# Altium schematic sheet H-bridge.SchDoc
size A3; SheetNumber: 1; SheetTotal: 1
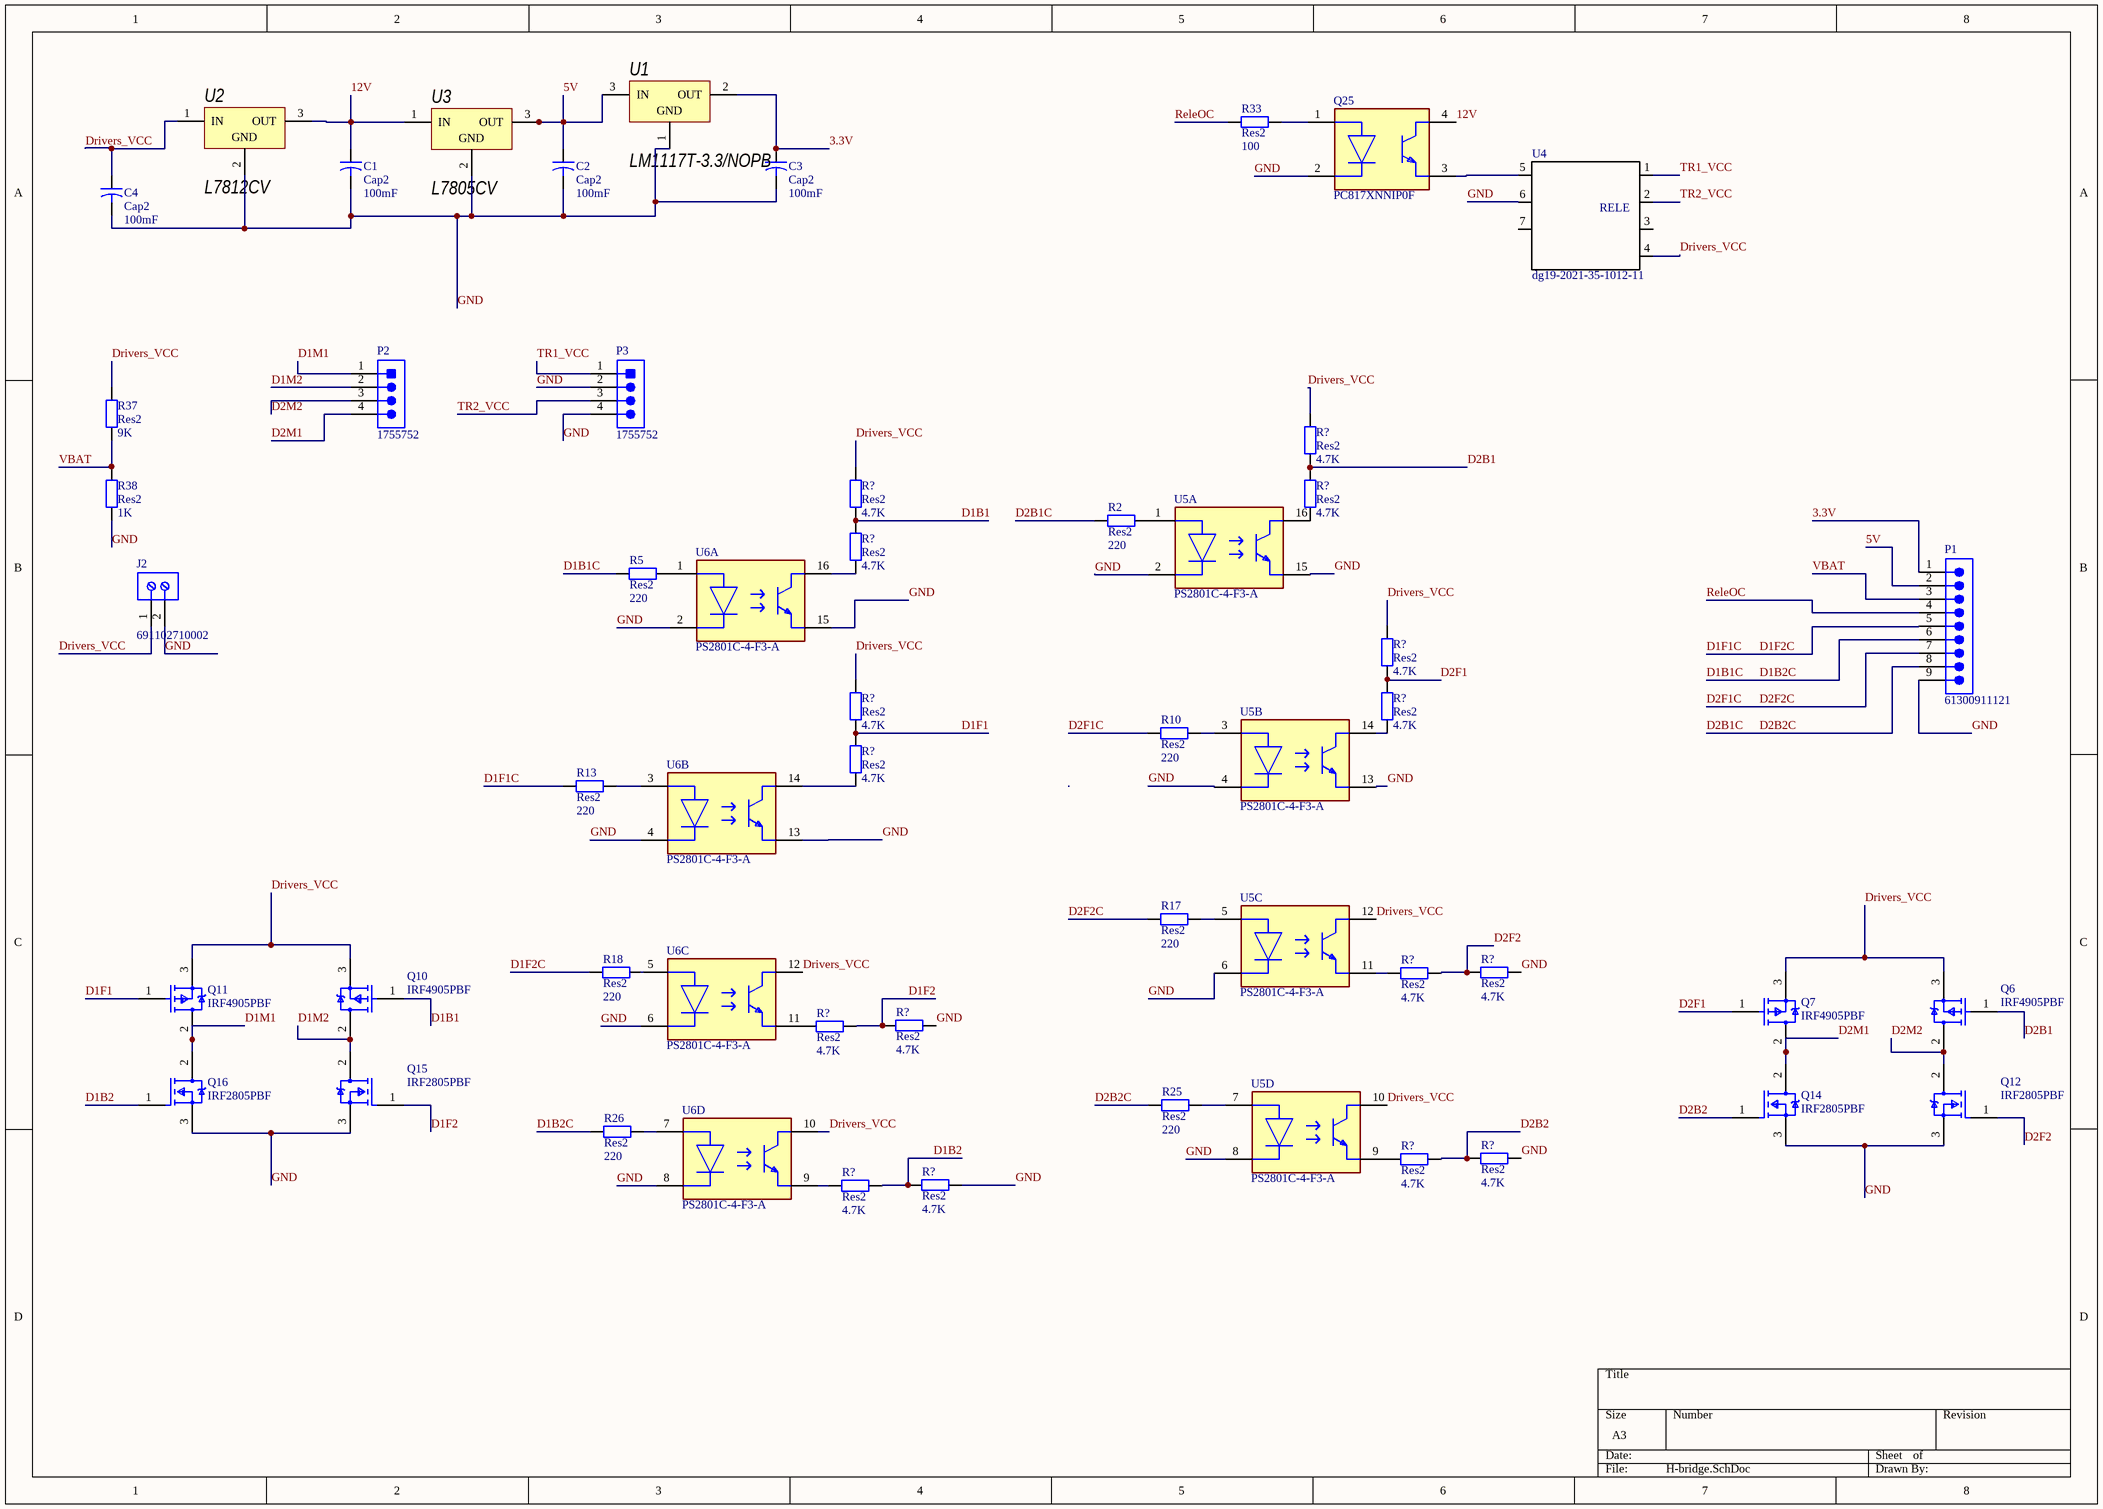
[diagram p0: H-bridge.SchDoc]

## Parts
(Parts that share a designator on the sheet are numbered #1, #2 ... from top to bottom, then left to right.)
C1  Cap2  value 100mF  [CAPR5-4X5]
C2  Cap2  value 100mF  [CAPR5-4X5]
C3  Cap2  value 100mF  [CAPR5-4X5]
C4  Cap2  value 100mF  [CAPR5-4X5]
J2  691102710002  [691102710002]
P1  61300911121  [61300911121]
P2  1755752  [PHOE-1755752-4_V]
P3  1755752  [PHOE-1755752-4_V]
Q6  IRF4905PBF  [FP-PG-TO220-3-MFG]
Q7  IRF4905PBF  [FP-PG-TO220-3-MFG]
Q10  IRF4905PBF  [FP-PG-TO220-3-MFG]
Q11  IRF4905PBF  [FP-PG-TO220-3-MFG]
Q12  IRF2805PBF  [FP-PG-TO220-3-MFG]
Q14  IRF2805PBF  [FP-PG-TO220-3-MFG]
Q15  IRF2805PBF  [FP-PG-TO220-3-MFG]
Q16  IRF2805PBF  [FP-PG-TO220-3-MFG]
Q25  PC817XNNIP0F  [FP-PC817XNNIP0F-MFG]
R2  Res2  value 220  [AXIAL-0.4]
R5  Res2  value 220  [AXIAL-0.4]
R10  Res2  value 220  [AXIAL-0.4]
R13  Res2  value 220  [AXIAL-0.4]
R17  Res2  value 220  [AXIAL-0.4]
R18  Res2  value 220  [AXIAL-0.4]
R25  Res2  value 220  [AXIAL-0.4]
R26  Res2  value 220  [AXIAL-0.4]
R33  Res2  value 100  [AXIAL-0.4]
R37  Res2  value 9K  [AXIAL-0.4]
R38  Res2  value 1K  [AXIAL-0.4]
R?#1  Res2  value 4.7K  [AXIAL-0.4]
R?#2  Res2  value 4.7K  [AXIAL-0.4]
R?#3  Res2  value 4.7K  [AXIAL-0.4]
R?#4  Res2  value 4.7K  [AXIAL-0.4]
R?#5  Res2  value 4.7K  [AXIAL-0.4]
R?#6  Res2  value 4.7K  [AXIAL-0.4]
R?#7  Res2  value 4.7K  [AXIAL-0.4]
R?#8  Res2  value 4.7K  [AXIAL-0.4]
R?#9  Res2  value 4.7K  [AXIAL-0.4]
R?#10  Res2  value 4.7K  [AXIAL-0.4]
R?#11  Res2  value 4.7K  [AXIAL-0.4]
R?#12  Res2  value 4.7K  [AXIAL-0.4]
R?#13  Res2  value 4.7K  [AXIAL-0.4]
R?#14  Res2  value 4.7K  [AXIAL-0.4]
R?#15  Res2  value 4.7K  [AXIAL-0.4]
R?#16  Res2  value 4.7K  [AXIAL-0.4]
U1  LM1117T-3.3/NOPB  [NDE0003A]
U2  L7812CV  [TO220]
U3  L7805CV  [TO220]
U4  dg19-2021-35-1012-11  [DG19-2021-35-1012-11]
U5  PS2801C-4-F3-A  [FP-PS2801C-4-F3-A-MFG]  (parts A,B,C,D of 4)
U6  PS2801C-4-F3-A  [FP-PS2801C-4-F3-A-MFG]  (parts A,B,C,D of 4)

## Nets
3.3V: C3.1 P1.1 U1.2(OUT)
5V: C2.1 P1.2 U1.3(IN) U3.3(OUT)
12V: C1.1 Q25.4(C) U2.3(OUT) U3.1(IN)
D1B1: Q10.1(GATE) R?#2.2 R?#4.1
D1B1C: P1.6 R5.1 R26.1  [also labelled D1B2C]
D1B2: Q16.1(G) R?#15.1 R?#16.2
D1F1: Q11.1(GATE) R?#6.2 R?#8.1
D1F1C: P1.5 R13.1 R18.1  [also labelled D1F2C]
D1F2: Q15.1(G) R?#11.1 R?#12.2
D1M1: P2.1 Q11.2(DRAIN) Q16.2(D)
D1M2: P2.2 Q10.2(DRAIN) Q15.2(D)
D2B1: Q6.1(GATE) R?#1.2 R?#3.1
D2B1C: P1.8 R2.1 R25.1  [also labelled D2B2C]
D2B2: Q14.1(G) R?#13.1 R?#14.2
D2F1: Q7.1(GATE) R?#5.2 R?#7.1
D2F1C: P1.7 R10.1 R17.1  [also labelled D2F2C]
D2F2: Q12.1(G) R?#9.1 R?#10.2
D2M1: P2.4 Q7.2(DRAIN) Q14.2(D)
D2M2: P2.3 Q6.2(DRAIN) Q12.2(D)
Drivers_VCC: C4.1 J2.1 Q6.3(SOURCE) Q7.3(SOURCE) Q10.3(SOURCE) Q11.3(SOURCE) R37.2 R?#1.1 R?#2.1 R?#5.1 R?#6.1 U2.1(IN) U4.4(VCC_NC) U5.10(C) U5.12(C) U6.10(C) U6.12(C)
GND: C1.2 C2.2 C3.2 C4.2 J2.2 P1.9 P3.2 P3.4 Q12.3(S) Q14.3(S) Q15.3(S) Q16.3(S) Q25.2(C) R38.1 R?#10.1 R?#12.1 R?#14.1 R?#16.1 U1.1(GND) U2.2(GND) U3.2(GND) U4.6(CP_2) U5.2(1_CATHODE) U5.4(2_CATHODE) U5.6(3_CATHODE) U5.8(4_CATHODE) U5.13(E) U5.15(E) U6.2(1_CATHODE) U6.4(2_CATHODE) U6.6(3_CATHODE) U6.8(4_CATHODE) U6.13(E) U6.15(E)
ReleOC: P1.4 R33.1
TR1_VCC: P3.1 U4.1(output1)
TR2_VCC: P3.3 U4.2(output2)
VBAT: P1.3 R37.1 R38.2
NetQ25_1: Q25.1(A) R33.2
NetQ25_3: Q25.3(E) U4.5(CP_1)
NetR2_2: R2.2 U5.1(1_ANODE)
NetR5_2: R5.2 U6.1(1_ANODE)
NetR10_2: R10.2 U5.3(2_ANODE)
NetR13_2: R13.2 U6.3(2_ANODE)
NetR17_2: R17.2 U5.5(3_ANODE)
NetR18_2: R18.2 U6.5(3_ANODE)
NetR25_2: R25.2 U5.7(4_ANODE)
NetR26_2: R26.2 U6.7(4_ANODE)
NetR?#3_2: R?#3.2 U5.16(C)
NetR?#4_2: R?#4.2 U6.16(C)
NetR?#7_2: R?#7.2 U5.14(C)
NetR?#8_2: R?#8.2 U6.14(C)
NetR?#9_2: R?#9.2 U5.11(E)
NetR?#11_2: R?#11.2 U6.11(E)
NetR?#13_2: R?#13.2 U5.9(E)
NetR?#15_2: R?#15.2 U6.9(E)

Not connected (* = marked no-connect by the designer): U4 3(VCC_NO) 7(output3)

## Notes on the sheet
- (in symbol dg19-2021-35-1012-11) RELE

## Library data of the parts
C1-C4 = Cap2: Capacitor; Published: 23-Sep-2002; PackageReference: CAPR5-4X5; Publisher: Altium Limited; PackageDescription: Capacitor; 2 Leads
J2 = CMP-1502-03258-1: Series 102 - 5.00 mm Horizontal Entry Modular with Pressure Clamp WR-TBL, 2 pin; Manufacturer: Wurth Elektronik; Pin Number: 2; Pitch: 5.00mm; Manufacturer URL: http://www.we-online.de; Mounting Technology: THT; Publisher: WurthElektronik; Packaging: Box; Package Reference: 691102710002; Datasheet URL: http://katalog.we-online.de/em/datasheet/6911027100xx.pdf; Operating Temperature: -40to105degC; Part Number: 691102710002
P1 = CMP-1502-01080-2: NexarPartId: 32855536; Number of Contacts: 9; Current Rating: 3A; Operating Supply Voltage: 250V; Connector Type: Male Pin; Gender: Male; Contact Resistance: 20mΩ; Pitch: 2.54mm; Number of Rows: 1; Number of Pins: 9; Termination: Solder; REACH SVHC: Unknown; Orientation: Vertical; Contact Plating: Gold; Mount: Through Hole; RoHS: Compliant; Number of Positions: 9; Color: Black; Lead Pitch: 2.54mm; Packaging: Bulk; Contact Mating Length: 5.9944mm; Contact Material: Copper
P2 P3 = CMP-2000-05301-1: Male Header, Pitch 5.08 mm, 1 x 4 Position, Height 12 mm, Tail Length 3.9 mm, 4-Pin THD, RoHS, Bulk; Manufacturer: Phoenix Contact; Pitch: 5.08mm; Number of contacts: 4; Industrial packaging: Yes; Content: 250pc(s); Manufacturer URL: http://www.phoenixcontact.com/; Datasheet URL: https://datasheet.ciiva.com/29210/569389-da-01-en-grundgehaeuse-1755752-250-st-29210608.pdf; Colour: Green; Datasheet Version: Nov-13; Type: MSTBVA2,5/4-G-5,08; Manufacturer part No.: 1755752
Q6 Q7 Q10 Q11 = CMP-32901-000200-1: MOSFET P-CH 55V 74A TO-220AB; Drain to Source Resistance: 20mR; Input Capacitance: 3.4nF; Max Dual Supply Voltage: -55V; Power Dissipation: 200W; Turn-On Delay Time: 18ns; Element Configuration: Single; Threshold Voltage: -4V; Gate to Source Voltage (Vgs): 20V; Turn-Off Delay Time: 61ns; Number of Pins: 3; Packaging: Rail/Tube; RoHS Compliant: Yes; REACH SVHC: No SVHC; Halogen Free: Halogen Free; Max Power Dissipation: 200W; Drain to Source Breakdown Voltage: -55V; Length: 0.414inch; Drain to Source Voltage (Vdss): -55V; Height: 0.6inch; Case/Package: TO-220; Width: 0.185inch; Continuous Drain Current (ID): 74A; Mount: Through Hole; Min Operating Temperature: -55°C; Lead Free: Lead Free; Max Operating Temperature: 175°C; Rds On Max: 20mR
Q12 Q14-Q16 = CMP-32901-001056-1: MOSFET N-CH 55V 75A TO220AB; Element Configuration: Single; Drain to Source Resistance: 4.7mR; Power Dissipation: 330W; Threshold Voltage: 4V; Turn-On Delay Time: 14ns; Gate to Source Voltage (Vgs): 20V; Polarization: N; Turn-Off Delay Time: 68ns; Input Capacitance: 5.11nF; Max Dual Supply Voltage: 55V; Number of Pins: 3; RoHS Compliant: Yes; REACH SVHC: No SVHC; Case/Package: TO-220; Rds On Max: 4.7mR; Width: 0.19inch; Min Operating Temperature: -55°C; Drain to Source Breakdown Voltage: 55V; Packaging: Rail/Tube; Lead Free: Lead Free; Length: 0.42inch; Max Operating Temperature: 175°C; Series: HEXFET®; Drain to Source Voltage (Vdss): 55V; Max Power Dissipation: 330W; Continuous Drain Current (ID): 75A; Height: 0.65inch; Halogen Free: Halogen Free; Mount: Through Hole
Q25 = CMP-65434-000005-1: OPTOISOLATOR 5KV TRANS 4SMD; Reverse Breakdown Voltage: 6V; Output Current per Channel: 30mA; Power Dissipation: 200mW; Collector-emitter Voltage-Max: 200mV; Max Output Voltage: 80V; Input Current: 50mA; Forward Voltage: 1.4V; Fall Time: 18000ns; Number of Elements: 1; Input Type: DC; Packaging: Tape and Reel; RoHS Compliant: Yes; Contact Plating: Copper; Min Operating Temperature: -30°C; Collector Emitter Saturation Voltage: 200mV; Max Input Current: 50mA; Radiation Hardening: No; Max Collector Current: 50mA; Case/Package: SMD/SMT; Mount: Surface Mount; Output Voltage: 80V; Forward Current: 50mA; Max Power Dissipation: 200mW; Collector Emitter Voltage (VCEO): 80V; Number of Channels: 1; Rise Time: 18000ns; Isolation Voltage: 5kV; Number of Pins: 4; Lead Free: Lead Free; Package Quantity: 2000; Isolation Voltage-Max: 5kV; Max Operating Temperature: 100°C
R2 R5 R10 R13 R17 R18 R25 R26 R33 R37 R38 R?#1-R?#16 = Res2: Resistor; Published: 8-Jun-2000; LatestRevisionDate: 17-Jul-2002; LatestRevisionNote: Re-released for DXP Platform.; PackageReference: AXIAL-0.4; Publisher: Altium Limited; PackageDescription: Axial Device, Thru-Hole; 2 Leads; 0.4 in Pin Spacing
U1 = CMP-0062-02494-3: 800mA Low-Dropout Linear Regulator, 3-pin TO-220, Pb-Free; Manufacturer: Texas Instruments; PackageTopMarking: NSUZXYTTE#*LM1117T*3.3; PowerWise: N; CompType: LDO IC; RoHS: Y; ComponentLink1URL: http://www.ti.com/general/docs/lit/getliterature.tsp?genericPartNumber=LM1117-N&fileType=pdf; PackageReference: NDE0003A; PinCount: 3; ComponentLink1Description: Datasheet URL; PackageDescription: TO-220, Molded, 3 Lead, Straight
U2 = CMP-0244-00450-1: Positive Voltage Regulator, 12V, 3-Pin TO-220; PackageDescription: TO, Thru-Hole, Vertical, Heatsink Mounted; 3 In-Line Leads; Pitch 2.54 mm; ComponentLink3URL: http://www.st.com/internet/com/TECHNICAL_RESOURCES/TECHNICAL_LITERATURE/PACKAGE_INFORMATION/CD00004649.pdf; ComponentLink1URL: http://www.st.com; ComponentLink2Description: Datasheet; ComponentLink3Description: Package Specification; ComponentLink2URL: http://www.st.com/internet/com/TECHNICAL_RESOURCES/TECHNICAL_LITERATURE/DATASHEET/CD00000444.pdf; DatasheetVersion: 16/11/2011; PackageVersion: ver3.0; PackageReference: TO220; ComponentLink1Description: Manufacturer URL
U3 = CMP-0244-00483-1: Positive Voltage Regulator, 5V, 3-Pin TO-220; PackageDescription: TO, Thru-Hole, Vertical, Heatsink Mounted; 3 In-Line Leads; Pitch 2.54 mm; ComponentLink2Description: Datasheet; PackageReference: TO220; ComponentLink3URL: http://www.st.com/internet/com/TECHNICAL_RESOURCES/TECHNICAL_LITERATURE/PACKAGE_INFORMATION/CD00004649.pdf; DatasheetVersion: 16/11/2011; ComponentLink1Description: Manufacturer URL; ComponentLink1URL: http://www.st.com; PackageVersion: ver3.0; ComponentLink3Description: Package Specification; ComponentLink2URL: http://www.st.com/internet/com/TECHNICAL_RESOURCES/TECHNICAL_LITERATURE/DATASHEET/CD00000444.pdf
U5 U6 = CMP-13576-000002-1: OPTOISO 2.5KV 4CH TRANS 16-SSOP; Input Type: DC; Current Transfer Ratio: 400%; Forward Current: 30mA; Forward Voltage: 1.4V; Output Voltage: 80V; Reverse Breakdown Voltage: 6V; Number of Elements: 4; Collector Emitter Saturation Voltage: 300mV; Input Current: 5mA; Radiation Hardening: No; Isolation Voltage: 2.5kV; RoHS Compliant: Yes; REACH SVHC: No SVHC; Mount: Surface Mount; Min Operating Temperature: -55°C; Number of Pins: 16; Case/Package: SSOP; Packaging: Tape and Reel; Lead Free: Lead Free; Collector Emitter Voltage (VCEO): 80V; Max Operating Temperature: 100°C